# Altium schematic sheet Sheet7.SchDoc
size A3; SheetNumber: 1; SheetTotal: 1
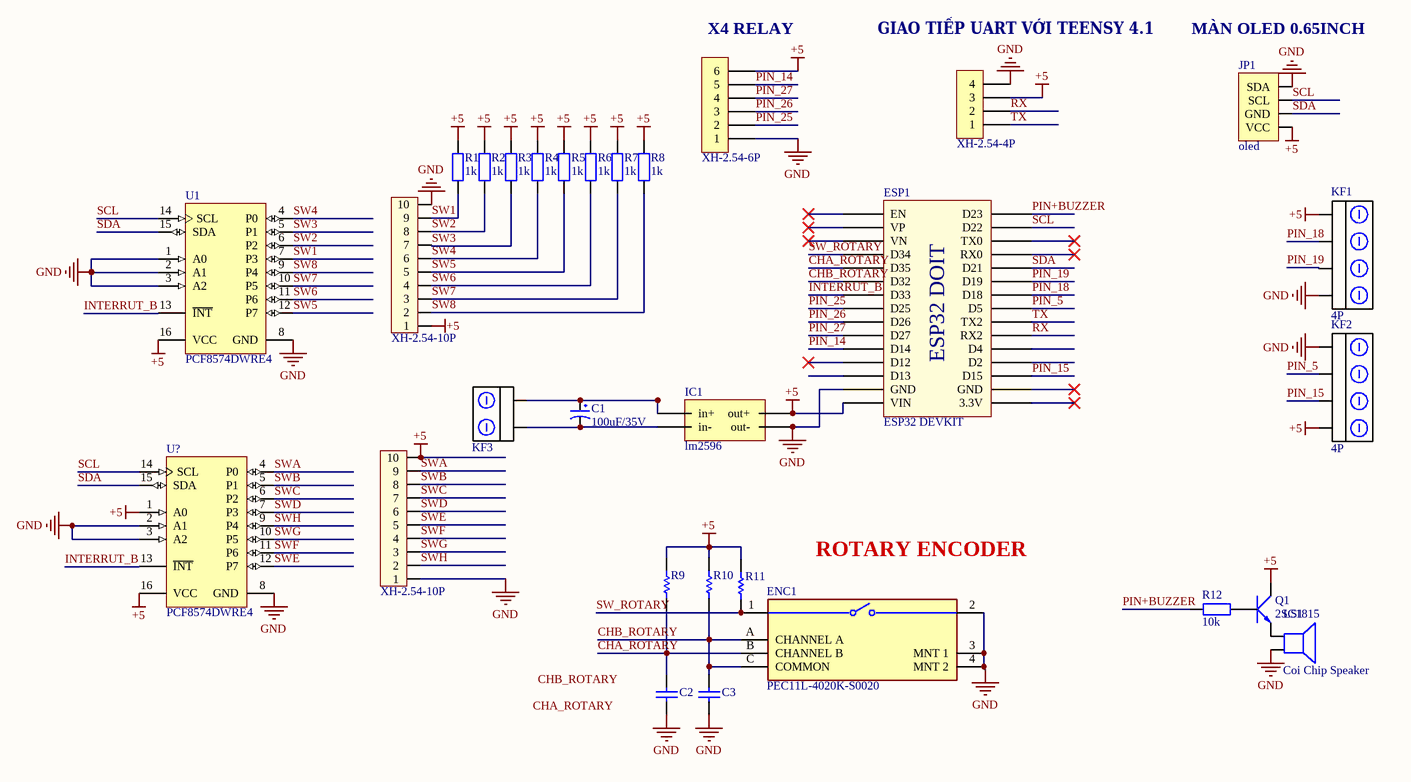
[diagram p0: Sheet7.SchDoc]

## Parts
C1  100uF/35V  [CP1.5/3.4]
C2  C0805X104K4RACTU  [CAPC2113X100X50ML30T10]  (value not drawn)
C3  C0805X104K4RACTU  [CAPC2113X100X50ML30T10]  (value not drawn)
ENC1  PEC11L-4020K-S0020  [FP-PEC11L-4020K-S0020-MFG]
ESP1  ESP32 DEVKIT  [ESP32 WROOM 32 KIT]
H1  XH-2.54-6P  [XH2.54M-6]
H2  XH-2.54-4P  [XH2.54M-4]
H3  XH-2.54-10P  [XH2.54M-10]
H?  XH-2.54-10P  [XH2.54M-10]
IC1  lm2596  [lm2596]
JP1  oled  [oled 0.96]
KF1  4P  [KF128-4P]
KF2  4P  [KF128-4P]
KF3  2P  [KF128-2P]  (value not drawn)
LS1  Coi Chip Speaker  [Coi Chip Speacker]
Q1  2SC1815  [TO92-123]
R1  1k  [R1/4W]
R2  1k  [R1/4W]
R3  1k  [R1/4W]
R4  1k  [R1/4W]
R5  1k  [R1/4W]
R6  1k  [R1/4W]
R7  1k  [R1/4W]
R8  1k  [R1/4W]
R9  10K 5% 0805(2012)  [RESC0805(2012)_L]  (value not drawn)
R10  10K 5% 0805(2012)  [RESC0805(2012)_L]  (value not drawn)
R11  10K 5% 0805(2012)  [RESC0805(2012)_L]  (value not drawn)
R12  10k  [tro smd 0805]
U1  PCF8574DWRE4  [DW16_L]
U?  PCF8574DWRE4  [DW16_L]

## Nets
+5: ESP1.15(VIN) H1.6 H2.3 H3.1 H?.10 IC1.4(out+) JP1.1(VCC) KF1.4 KF2.1 Q1.2(C) R1.2 R2.2 R3.2 R4.2 R5.2 R6.2 R7.2 R8.2 R9.2 R10.2 R11.2 U1.16(VCC) U?.1(A0) U?.16(VCC)
GND: C2.1 C3.1 ENC1.2 ENC1.3(MNT_1) ENC1.4(MNT_2) ESP1.14(GND) H1.1 H2.4 H3.10 H?.1 IC1.3(out-) JP1.4(SDA) KF1.1 KF2.4 LS1.2 U1.1(A0) U1.2(A1) U1.3(A2) U1.8(GND) U?.2(A1) U?.3(A2) U?.8(GND)
CHA_ROTARY: C2.2 ENC1.B(CHANNEL_B) ESP1.5(D35) R9.1
CHB_ROTARY: C3.2 ENC1.A(CHANNEL_A) ENC1.C(COMMON) ESP1.6(D32) R10.1
INTERRUT_B: ESP1.7(D33) U1.13(~{INT}) U?.13(~{INT})
PIN+BUZZER: ESP1.30(D23) R12.1
PIN_5: ESP1.23(D5) KF2.3
PIN_14: ESP1.11(D14) H1.5
PIN_15: ESP1.18(D15) KF2.2
PIN_18: ESP1.24(D18) KF1.3
PIN_19: ESP1.25(D19) KF1.2
PIN_25: ESP1.8(D25) H1.2
PIN_26: ESP1.9(D26) H1.3
PIN_27: ESP1.10(D27) H1.4
RX: ESP1.21(RX2) H2.2
SCL: ESP1.29(D22) JP1.3(SCL) U1.14(SCL) U?.14(SCL)
SDA: ESP1.26(D21) JP1.2(GND) U1.15(SDA) U?.15(SDA)
SW1: H3.9 R1.1 U1.7(P3)
SW2: H3.8 R2.1 U1.6(P2)
SW3: H3.7 R3.1 U1.5(P1)
SW4: H3.6 R4.1 U1.4(P0)
SW5: H3.5 R5.1 U1.12(P7)
SW6: H3.4 R6.1 U1.11(P6)
SW7: H3.3 R7.1 U1.10(P5)
SW8: H3.2 R8.1 U1.9(P4)
SW_ROTARY: ENC1.1 ESP1.4(D34) R11.1
SWA: H?.9 U?.4(P0)
SWB: H?.8 U?.5(P1)
SWC: H?.7 U?.6(P2)
SWD: H?.6 U?.7(P3)
SWE: H?.5 U?.12(P7)
SWF: H?.4 U?.11(P6)
SWG: H?.3 U?.10(P5)
SWH: H?.2 U?.9(P4)
TX: ESP1.22(TX2) H2.1
NetC1_1: C1.1 IC1.1(in+) KF3.1
NetC1_2: C1.2 IC1.2(in-) KF3.2
NetLS1_1: LS1.1 Q1.1(E)
NetQ1_3: Q1.3(B) R12.2

Not connected (* = marked no-connect by the designer): ESP1 1(EN)* 2(VP)* 3(VN)* 12(D12)* 13(D13) 16(3.3V)* 17(GND)* 19(D2) 20(D4) 27(RX0)* 28(TX0)*

## Notes on the sheet
- (near H1) X4 RELAY
- (near H2) GIAO TIẾP UART VỚI TEENSY 4.1
- (near JP1) MÀN OLED 0.65INCH
- ROTARY ENCODER
- Labels drawn without touching a wire or pin: CHA_ROTARY, CHB_ROTARY
- (in symbol ESP32 WROOM 32 KIT) ESP32 DOIT

## Library data of the parts
C1 = CP3: Cap 100uF/35V - 470uF/16V; Value: 100uF/35V/50V; Description 1: 1000uF/6,3V - 470uF/16V - 330uF - 25V; Description 2: 220uF/35V - 100uF/50V - 63V - 4,7uF/200V; Description 3: 22uF => 33uF100V - 3,3uF => 4,7uF/250V; Description 4: 2,2uF =>3,3uF/350 - 2,2uF/400V - 1uF/450V
C2 C3 = CMP-2007-00010-1: Manufacturer: Kemet; Part Number: C0805X104K4RACTU
ENC1 = CMP-07421-000057-1: ROTARY ENCODER; Number of Channels: 2; Output Type: Quadrature; Max Operating Temperature: 80°C; Min Operating Temperature: -25°C; Width: 11.8mm; RoHS Compliant: Yes; Height: 12mm; Package Quantity: 75; Packaging: Bulk; Length: 24.5mm; Termination: Through Hole
ESP1 = ESP32 WROOM 32 KIT
H1 = XH-2.54-6P: Ten_Linh_Kien: Header 6P XH2.54-6P Đực Thẳng; Don_Vi: Con; Ma_Hang: MH001972; Chung_Loai: Cắm; Value: XH-2.54-6P
H2 = XH-2.54-4P: Ten_Linh_Kien: Header 4P XH2.54-4P Đực Thẳng; Don_Vi: Con; Ma_Hang: MH001285; Chung_Loai: Cắm; Value: XH-2.54-4P
H3 H? = XH-2.54-10P: Ten_Linh_Kien: Header 10P XH2.54-10P Đực Thẳng; Don_Vi: Con; Ma_Hang: MH001286; Chung_Loai: Cắm; Value: XH-2.54-10P
IC1 = lm2596 DC-DC: BOARD MODULE
JP1 = oled 0.96: Ten_Linh_Kien: Jump Đơn Cái 2.54MM 1x20P Thẳng; Don_Vi: Con; Ma_Hang: MH004006; Chung_Loai: Cắm; Ghi_Chu: *; Kieu_Chan: *
KF1 KF2 = KF128 4P 5.08MM: DOMINO 5.08MM
KF3 = KF128 2P 5.08MM: DOMINO 5.08MM; Value: Domino KF128 2P GREEN
LS1 = Coi Chip Speaker: Còi chip
Q1 = 2SC1815: NPN 600mW, ECB; Value: C1815
R1-R8 = R1/4W: Resistor 1/4W; Value: R1/4W - 1K
R9-R11 = CMP-1013-00098-1: 10K 0.125W 5% 0805 (2012 Metric)  SMD; Case-EIA: 0805; Case-Metric: 2012; Value: 10000.00 Ohm; Power: 0.125 W; Technology: SMT; Tolerance: 5 %
R12 = Tro 0805 1% 10k: Dán; Don_Vi: Con; So_Chan: 2; Ten_Linh_Kien: Trở 0805 1% 10k; Ma_Hang: MH005473; Chung_Loai: Dán; Kieu_Chan: *
U1 U? = CMP-0314-00118-1: Remote 8-Bit I/O Expander for I2C-Bus, 2.5 to 6 V, -40 to 85 degC, 16-pin SOIC (DW), Green (RoHS & no Sb/Br); Manufacturer: Texas Instruments; Voltage Nodes(V): 5, 3.3; # of I/Os: 8; Interrupt Output: Yes; Max Frequency(kHz): 100; fSCLK(Max)(MHz): 0.1; Vcc range(V): 2.5 to 6.0; VCC(Min)(V): 2.5; VCC(Max)(V): 6; I2C Address: 0100 xxx; SubFamily: I2C IO Expander; Eco-Plan: Green (RoHS & no Sb/Br); ComponentLink2Description: Package Specification; PackageDescription: 16-Pin Small Outline Integrated Circuit, 10.3 x 7.5 mm, Pitch 1.27 mm Pitch; PackageReference: DW16; Push-Pull I/O Type: Yes; ComponentLink1Description: Datasheet; ComponentLink1URL: http://www.ti.com/general/docs/lit/getliterature.tsp?genericPartNumber=PCF8574&fileType=pdf; ComponentLink2URL: http://www.ti.com/litv/pdf/msoi003g; DatasheetVersion: SCPS068G; Code_JEDEC: MS-013-AA; PackageVersion: revG, Jan-2011; Mounting Technology: Surface Mount; PartNumber: PCF8574DWRE4; Reset Input: No